# EAGLE schematic FMBTECH2 (EAGLE 8.4.0)
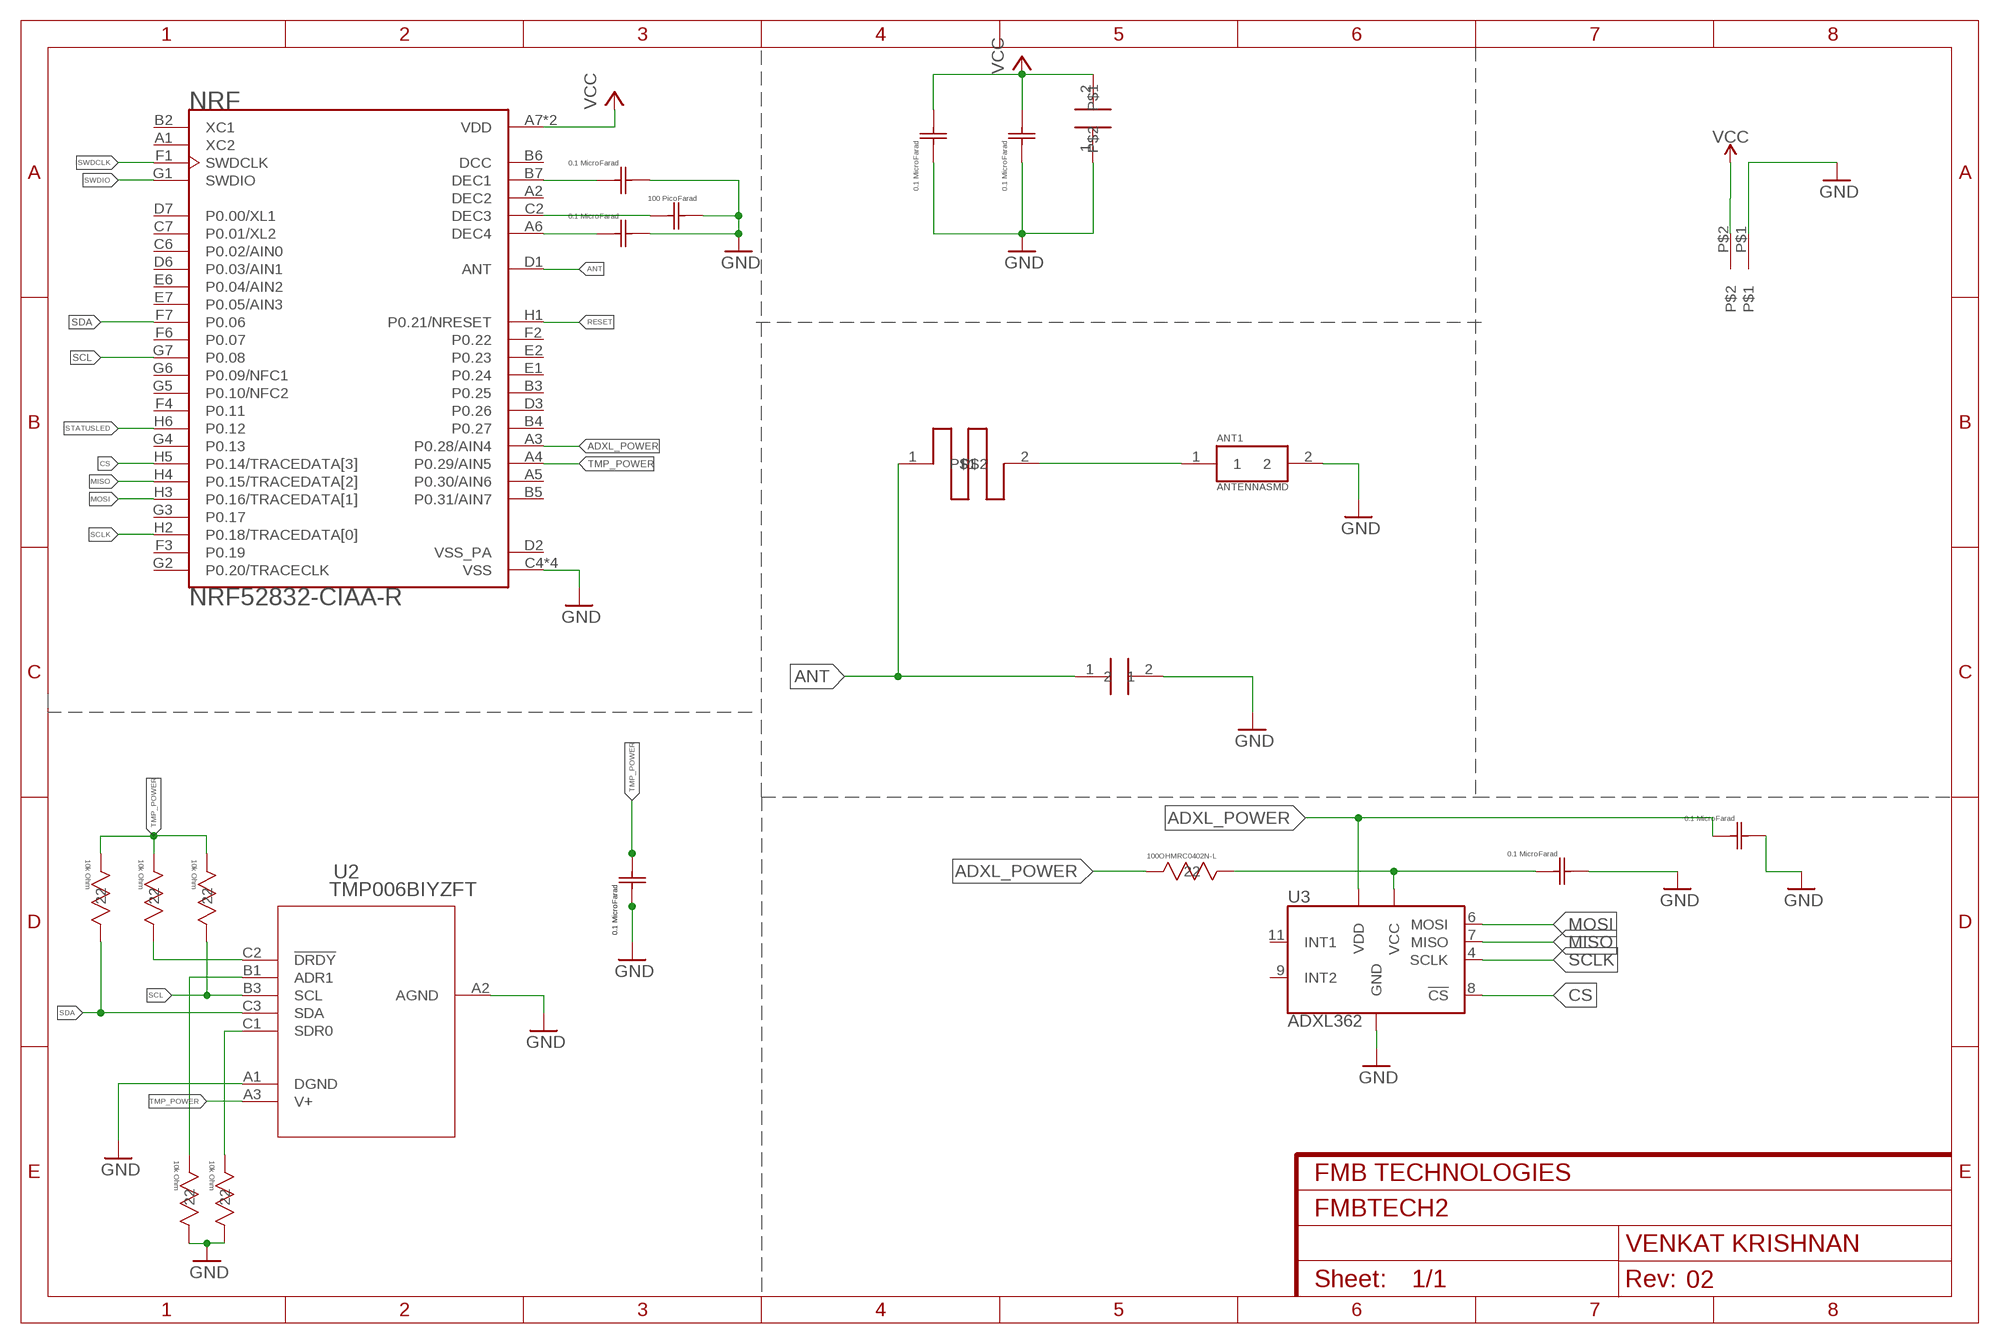
[diagram p0: schematic, sheet 1]

## Parts
ANT1  ANTENNASMD  [1]
C1  02016D104KAT2A  [0201]
C2  02016D104KAT2A  [0201]
C3  GRM0335C1E101JA01D  [G-033]
C4  02016D104KAT2A  [0201]
C5  02016D104KAT2A  [0201]
C6  02016D104KAT2A  [0201]
C7  02016D104KAT2A  [0201]
C8  02016D104KAT2A  [0201]
C9  02016D104KAT2A  [0201]
NRF  NRF52832-CIAA-R  [BGA50N40P7X8_300X320X40]
R1  RC0402JR-0710KL  [RC0402N]
R2  RC0402JR-0710KL  [RC0402N]
R3  RC0402JR-0710KL  [RC0402N]
R4  RC0402JR-0710KL  [RC0402N]
R5  RC0402JR-0710KL  [RC0402N]
R6  100OHMRC0402N-L  [RES]
U2  TMP006BIYZFT  [YZF8]
U3  ADXL362  [TFLGA-16/3.3MMX3.1MM]
U$1  4.7µF  [CAP]
U$2  0.8PF  [CAP]
U$3  INDUCTOR  [1]
U$4  SUPPLY  [SUPPLY]

## Nets
ADXL_POWER: C9.1 NRF.A3(P0.28/AIN4) R6.1 U3.1(VDD)
ANT: NRF.D1(ANT) U$2.1 U$3.1
CS: NRF.H5(P0.14/TRACEDATA[3]) U3.8(!CS)
GND: ANT1.2 C1.2 C2.2 C3.2 C4.1 C5.1 C6.1 C7.1 C8.2 C9.2 NRF.C4(VSS) NRF.C5(VSS) NRF.E3(VSS) NRF.F5(VSS) R4.1 R5.1 U2.A1(DGND) U2.A2(AGND) U3.12(GND) U3.13(GND) U3.16(GND) U$1.1 U$2.2 U$4.P$1
MISO: NRF.H4(P0.15/TRACEDATA[2]) U3.7(MISO)
MOSI: NRF.H3(P0.16/TRACEDATA[1]) U3.6(MOSI)
N$1: R5.2 U2.C1(SDR0)
N$2: U2.C3(SDA)
N$3: R4.2 U2.B1(ADR1)
N$4: R3.1 U2.C2(!DRDY)
N$5: ANT1.1 U$3.2
N$6: C2.1 NRF.A6(DEC4)
N$8: C1.1 NRF.B7(DEC1)
N$9: C3.1 NRF.C2(DEC3)
N$10: C8.1 R6.2 U3.14(VCC)
RESET: NRF.H1(P0.21/NRESET)
SCL: NRF.G7(P0.08) R2.1 U2.B3(SCL)
SCLK: NRF.H2(P0.18/TRACEDATA[0]) U3.4(SCLK)
SDA: NRF.F7(P0.06) R1.1
STATUSLED: NRF.H6(P0.12)
SWDCLK: NRF.F1(SWDCLK)
SWDIO: NRF.G1(SWDIO)
TMP_POWER: C4.2 C5.2 NRF.A4(P0.29/AIN5) R1.2 R2.2 R3.2 U2.A3(V+)
VCC: C6.2 C7.2 NRF.A7(VDD) NRF.H7(VDD) U$1.2 U$4.P$2
Unconnected: NRF.A1(XC2) NRF.A5(P0.30/AIN6) NRF.B2(XC1) NRF.B3(P0.25) NRF.B4(P0.27) NRF.B5(P0.31/AIN7) NRF.C6(P0.02/AIN0) NRF.C7(P0.01/XL2) NRF.D3(P0.26) NRF.D6(P0.03/AIN1) NRF.D7(P0.00/XL1) NRF.E1(P0.24) NRF.E2(P0.23) NRF.E6(P0.04/AIN2) NRF.E7(P0.05/AIN3) NRF.F2(P0.22) NRF.F3(P0.19) NRF.F4(P0.11) NRF.F6(P0.07) NRF.G2(P0.20/TRACECLK) NRF.G3(P0.17) NRF.G4(P0.13) NRF.G5(P0.10/NFC2) NRF.G6(P0.09/NFC1) U3.9(INT2) U3.11(INT1)

## Power pins joined to a net without a drawn wire
DCC: NRF.B6(DCC)
DEC2: NRF.A2(DEC2)
VSS_PA: NRF.D2(VSS_PA)

## Library data of the parts
ANT1 = antenna:ANTENNA; AVAILABILITY: Good; DESCRIPTION: Bluetooth/WLAN/WiFi Ceramic Chip Antenna 3-Pin SMD; MF: Pulse; MP: W3008; PACKAGE: None; PRICE: 0.93 USD
C1 C2 C4-C9 = cap_1microfarad:02016D104KAT2A; MANUFACTURER_PART_NUMBER: 02016D104KAT2A; VENDOR: AVX Corporation
C3 = cap_100picofarad:GRM0335C1E101JA01D; MANUFACTURER_PART_NUMBER: GRM0335C1E101JA01D; VENDOR: Murata
NRF = NRF52832-CIAA-R:NRF52832-CIAA-R: Multi Protocal Bluetooth Smart ANT 2.4GHz RF SoC (WL-CSP); AVAILABILITY: Good; DESCRIPTION: Multi Protocal Bluetooth Smart ANT 2.4GHz RF SoC (WL-CSP); MF: Nordic Semiconductor; MP: NRF52832-CIAA-R; PACKAGE: XFBGA-50 Nordic Semiconductor; PRICE: 3.94 USD
R1-R5 = res_10kohm:RC0402JR-0710KL; MANUFACTURER_PART_NUMBER: RC0402JR0710KL; VENDOR: Yageo
R6 = 100ohm:100OHM; MANUFACTURER_PART_NUMBER: RC0402FR07100RL; VENDOR: Yageo
U2 = tmp006b:TMP006BIYZFT; MANUFACTURER_PART_NUMBER: TMP006BIYZFT; VENDOR: Texas Instruments
U3 = ADXL362:ADXL362: IC ACCEL DIG LO PWR 3AX 16LGA; AVAILABILITY: Good; DESCRIPTION: Accelerometer Triple ±2/±4/±8g 1.6V to 3.6V 16-Pin LGA T/R; MF: Analog Devices; MP: ADXL362BCCZ-RL7; PACKAGE: LGA-16 Analog Devices; PRICE: 6.52 USD
U$1 = 4p7microfarad:4.7µF
U$2 = 0p8picofarad:0.8PF
U$3 = inductor:INDUCTOR
U$4 = supply:SUPPLY